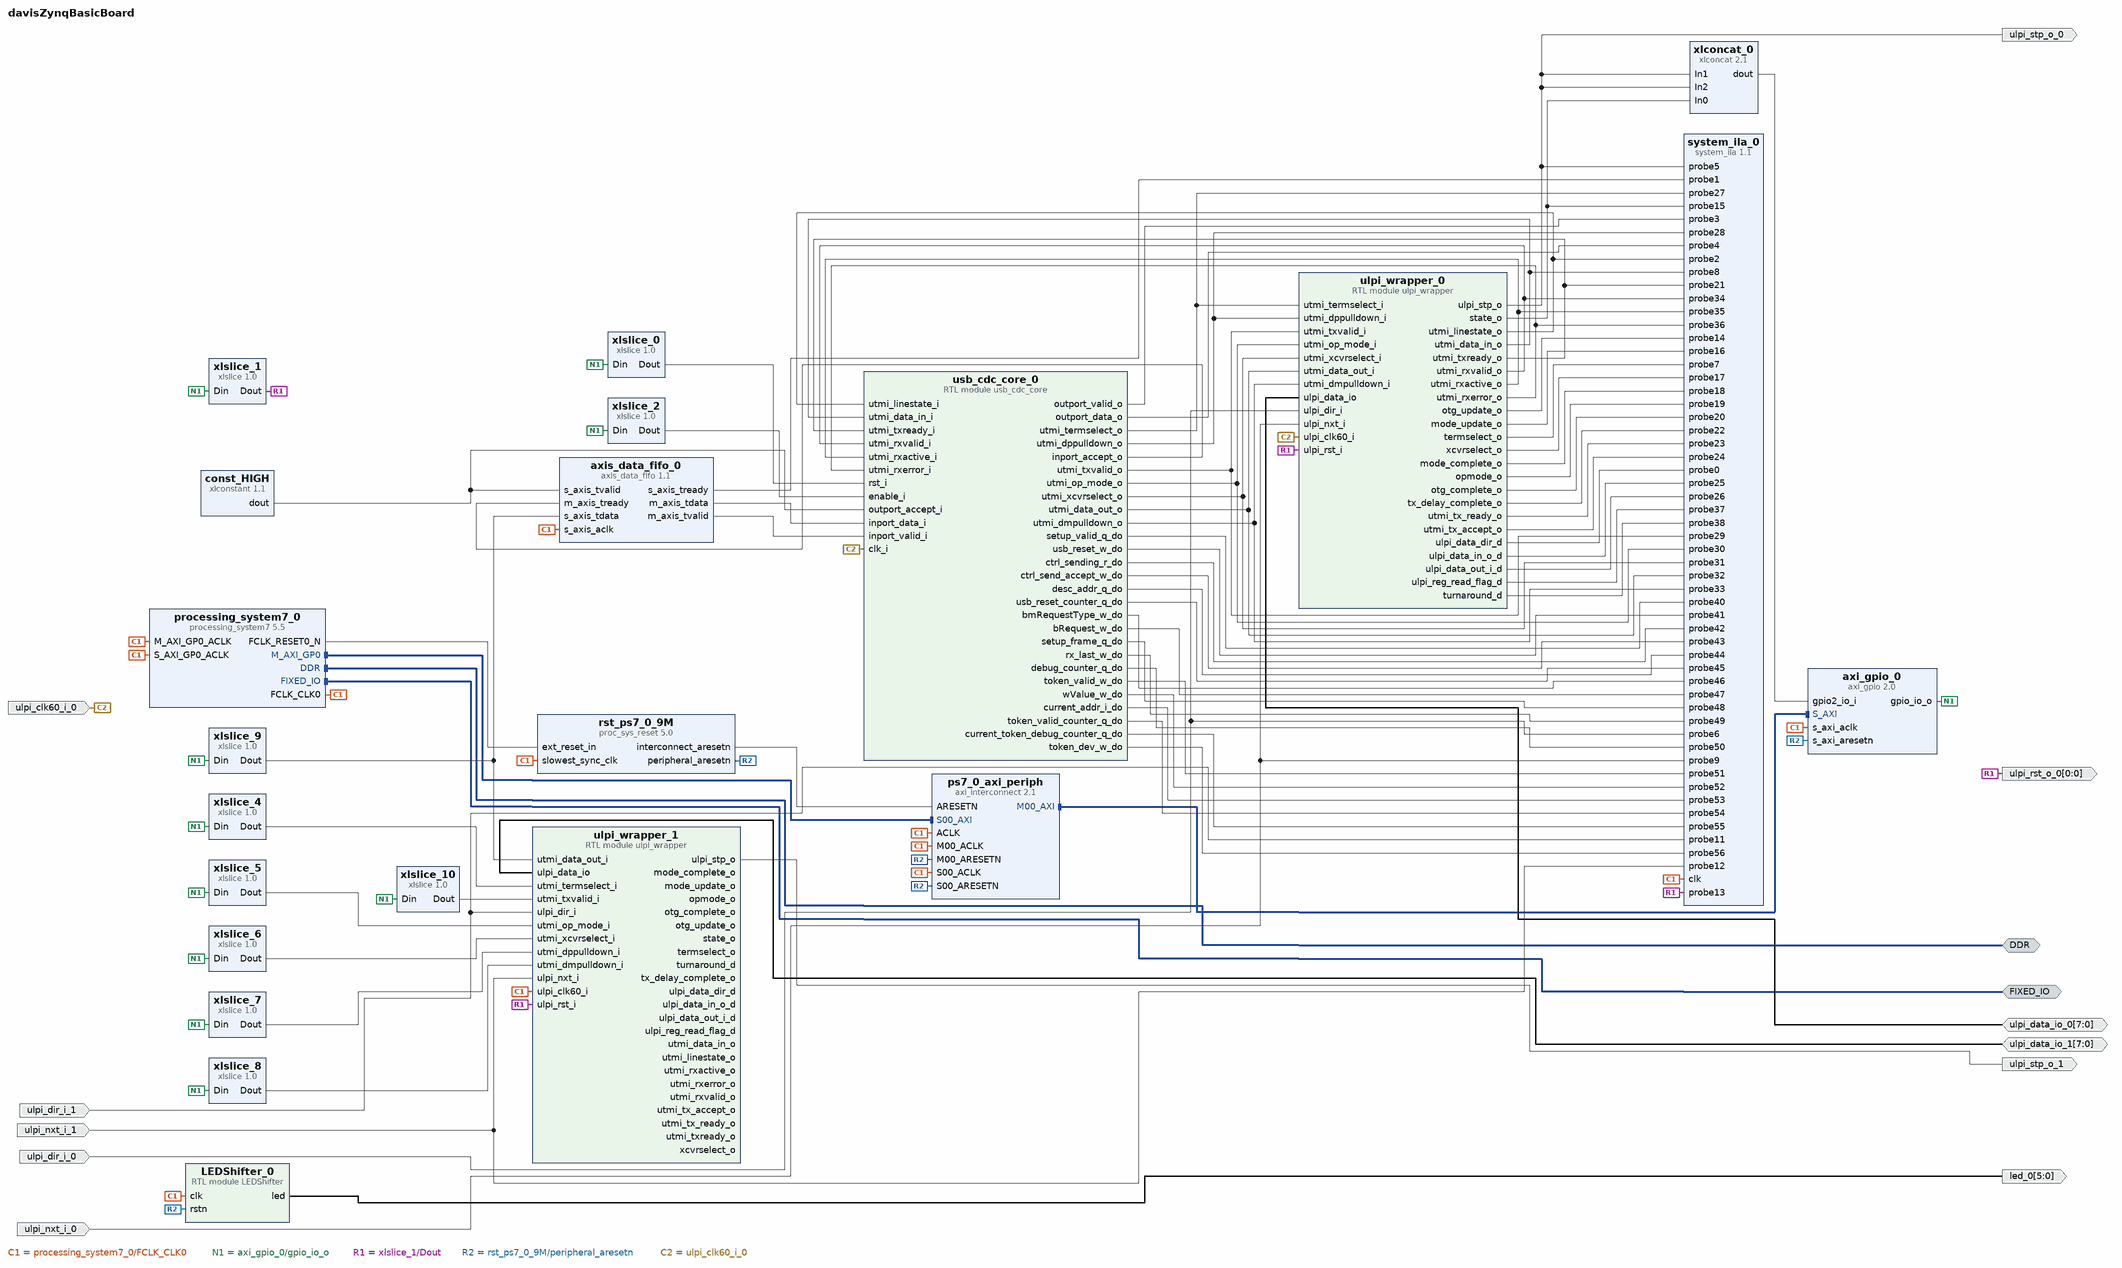
[diagram p0: block diagram of the top level]
# Vivado block design davisZynqBasicBoard, xc7z100ffg900-1, Vivado 2018.1
create_bd_design davisZynqBasicBoard

create_bd_intf_port -mode Master -vlnv xilinx.com:interface:ddrx_rtl:1.0 DDR
create_bd_intf_port -mode Master -vlnv xilinx.com:display_processing_system7:fixedio_rtl:1.0 FIXED_IO
create_bd_port -dir O -from 0 -to 0 ulpi_rst_o_0
create_bd_port -dir O ulpi_stp_o_0
create_bd_port -dir I ulpi_dir_i_0
create_bd_port -dir I ulpi_nxt_i_0
create_bd_port -dir IO -from 7 -to 0 ulpi_data_io_0
create_bd_port -dir I ulpi_dir_i_1
create_bd_port -dir I ulpi_nxt_i_1
create_bd_port -dir O ulpi_stp_o_1
create_bd_port -dir IO -from 7 -to 0 ulpi_data_io_1
create_bd_port -dir O -from 5 -to 0 led_0
create_bd_port -dir I ulpi_clk60_i_0

create_bd_cell -type ip -vlnv xilinx.com:ip:processing_system7:5.5 processing_system7_0
set_property -dict [list \
  CONFIG.PCW_FCLK_CLK2_BUF TRUE \
  CONFIG.PCW_UIPARAM_DDR_FREQ_MHZ 533.33333 \
  CONFIG.PCW_CRYSTAL_PERIPHERAL_FREQMHZ 33.33 \
  CONFIG.PCW_APU_PERIPHERAL_FREQMHZ 666.66666666666666666 \
  CONFIG.PCW_SDIO_PERIPHERAL_FREQMHZ 100 \
  CONFIG.PCW_UART_PERIPHERAL_FREQMHZ 100 \
  CONFIG.PCW_I2C_PERIPHERAL_FREQMHZ 111.099998 \
  CONFIG.PCW_FPGA0_PERIPHERAL_FREQMHZ 60 \
  CONFIG.PCW_FPGA1_PERIPHERAL_FREQMHZ 250 \
  CONFIG.PCW_FPGA2_PERIPHERAL_FREQMHZ 48 \
  CONFIG.PCW_USE_S_AXI_GP0 1 \
  CONFIG.PCW_USE_FABRIC_INTERRUPT 1 \
  CONFIG.PCW_EN_CLK2_PORT 1 \
  CONFIG.PCW_IRQ_F2P_INTR 1 \
  CONFIG.PCW_PERIPHERAL_BOARD_PRESET None \
  CONFIG.PCW_PRESET_BANK1_VOLTAGE {LVCMOS 3.3V} \
  CONFIG.PCW_UIPARAM_DDR_BUS_WIDTH {16 Bit} \
  CONFIG.PCW_UIPARAM_DDR_PARTNO Custom \
  CONFIG.PCW_NAND_PERIPHERAL_ENABLE 1 \
  CONFIG.PCW_NAND_NAND_IO {MIO 0 2.. 14} \
  CONFIG.PCW_ENET0_PERIPHERAL_ENABLE 0 \
  CONFIG.PCW_SD0_PERIPHERAL_ENABLE 1 \
  CONFIG.PCW_SD0_SD0_IO {MIO 16 .. 21} \
  CONFIG.PCW_SD0_GRP_CD_ENABLE 0 \
  CONFIG.PCW_SD0_GRP_WP_ENABLE 0 \
  CONFIG.PCW_UART0_PERIPHERAL_ENABLE 1 \
  CONFIG.PCW_UART0_UART0_IO {MIO 22 .. 23} \
  CONFIG.PCW_UART1_PERIPHERAL_ENABLE 0 \
  CONFIG.PCW_USB0_PERIPHERAL_ENABLE 1 \
  CONFIG.PCW_USB0_USB0_IO {MIO 28 .. 39} \
  CONFIG.PCW_USB1_PERIPHERAL_ENABLE 1 \
  CONFIG.PCW_USB1_USB1_IO {MIO 40 .. 51} \
  CONFIG.PCW_I2C0_PERIPHERAL_ENABLE 1 \
  CONFIG.PCW_I2C0_I2C0_IO {MIO 26 .. 27} \
  CONFIG.PCW_I2C0_GRP_INT_ENABLE 0 \
  CONFIG.PCW_I2C1_PERIPHERAL_ENABLE 1 \
  CONFIG.PCW_I2C1_I2C1_IO EMIO \
  CONFIG.PCW_GPIO_MIO_GPIO_ENABLE 0 \
  CONFIG.PCW_FPGA_FCLK2_ENABLE 1 \
] [get_bd_cells processing_system7_0]
# 502 more settings of processing_system7_0 are not shown: defaults, MIO pin electricals, DDR timing, and values the tool derives
create_bd_cell -type ip -vlnv xilinx.com:ip:proc_sys_reset:5.0 rst_ps7_0_9M
create_bd_cell -type ip -vlnv xilinx.com:ip:xlconstant:1.1 const_HIGH
create_bd_cell -type ip -vlnv xilinx.com:ip:axis_data_fifo:1.1 axis_data_fifo_0
create_bd_cell -type ip -vlnv xilinx.com:ip:system_ila:1.1 system_ila_0
set_property -dict [list \
  CONFIG.C_PROBE62_TYPE 0 \
  CONFIG.C_PROBE61_TYPE 0 \
  CONFIG.C_PROBE60_TYPE 0 \
  CONFIG.C_PROBE59_TYPE 0 \
  CONFIG.C_PROBE58_TYPE 0 \
  CONFIG.C_PROBE57_TYPE 0 \
  CONFIG.C_PROBE56_TYPE 0 \
  CONFIG.C_PROBE55_TYPE 0 \
  CONFIG.C_PROBE54_TYPE 0 \
  CONFIG.C_PROBE53_TYPE 0 \
  CONFIG.C_PROBE52_TYPE 0 \
  CONFIG.C_PROBE51_TYPE 0 \
  CONFIG.C_PROBE50_TYPE 0 \
  CONFIG.C_PROBE49_TYPE 0 \
  CONFIG.C_PROBE48_TYPE 0 \
  CONFIG.C_PROBE47_TYPE 0 \
  CONFIG.C_PROBE46_TYPE 0 \
  CONFIG.C_PROBE45_TYPE 0 \
  CONFIG.C_PROBE44_TYPE 0 \
  CONFIG.C_PROBE43_TYPE 0 \
  CONFIG.C_PROBE42_TYPE 0 \
  CONFIG.C_PROBE41_TYPE 0 \
  CONFIG.C_PROBE40_TYPE 0 \
  CONFIG.C_PROBE39_TYPE 0 \
  CONFIG.C_PROBE38_TYPE 0 \
  CONFIG.C_PROBE37_TYPE 0 \
  CONFIG.C_PROBE36_TYPE 0 \
  CONFIG.C_PROBE35_TYPE 0 \
  CONFIG.C_PROBE34_TYPE 0 \
  CONFIG.C_PROBE33_TYPE 0 \
  CONFIG.C_PROBE32_TYPE 0 \
  CONFIG.C_PROBE31_TYPE 0 \
  CONFIG.C_PROBE30_TYPE 0 \
  CONFIG.C_PROBE29_TYPE 0 \
  CONFIG.C_PROBE28_TYPE 0 \
  CONFIG.C_PROBE27_TYPE 0 \
  CONFIG.C_PROBE26_TYPE 0 \
  CONFIG.C_PROBE25_TYPE 0 \
  CONFIG.C_PROBE24_TYPE 0 \
  CONFIG.C_PROBE23_TYPE 0 \
  CONFIG.C_PROBE22_TYPE 0 \
  CONFIG.C_PROBE21_TYPE 0 \
  CONFIG.C_PROBE20_TYPE 0 \
  CONFIG.C_PROBE19_TYPE 0 \
  CONFIG.C_PROBE18_TYPE 0 \
  CONFIG.C_PROBE17_TYPE 0 \
  CONFIG.C_PROBE16_TYPE 0 \
  CONFIG.C_PROBE15_TYPE 0 \
  CONFIG.C_PROBE14_TYPE 0 \
  CONFIG.C_PROBE13_TYPE 0 \
  CONFIG.C_PROBE12_TYPE 0 \
  CONFIG.C_PROBE11_TYPE 0 \
  CONFIG.C_PROBE10_TYPE 0 \
  CONFIG.C_PROBE9_TYPE 0 \
  CONFIG.C_PROBE8_TYPE 0 \
  CONFIG.C_PROBE7_TYPE 0 \
  CONFIG.C_PROBE6_TYPE 0 \
  CONFIG.C_PROBE5_TYPE 0 \
  CONFIG.C_PROBE0_TYPE 0 \
  CONFIG.C_DATA_DEPTH 32768 \
  CONFIG.C_NUM_OF_PROBES 57 \
  CONFIG.C_MON_TYPE NATIVE \
] [get_bd_cells system_ila_0]
create_bd_cell -type ip -vlnv xilinx.com:ip:axi_gpio:2.0 axi_gpio_0
set_property -dict [list \
  CONFIG.C_IS_DUAL 1 \
  CONFIG.C_DOUT_DEFAULT 0x00000000 \
  CONFIG.C_ALL_INPUTS_2 1 \
  CONFIG.C_ALL_OUTPUTS 1 \
] [get_bd_cells axi_gpio_0]
create_bd_cell -type ip -vlnv xilinx.com:ip:xlslice:1.0 xlslice_0
set_property -dict {CONFIG.DIN_TO 0 CONFIG.DIN_FROM 0 CONFIG.DIN_WIDTH 32} [get_bd_cells xlslice_0]
create_bd_cell -type ip -vlnv xilinx.com:ip:xlslice:1.0 xlslice_1
set_property -dict {CONFIG.DIN_TO 1 CONFIG.DIN_FROM 1 CONFIG.DOUT_WIDTH 1} [get_bd_cells xlslice_1]
create_bd_cell -type ip -vlnv xilinx.com:ip:xlslice:1.0 xlslice_4
set_property -dict {CONFIG.DIN_TO 4 CONFIG.DIN_FROM 4 CONFIG.DOUT_WIDTH 1} [get_bd_cells xlslice_4]
create_bd_cell -type ip -vlnv xilinx.com:ip:xlslice:1.0 xlslice_5
set_property -dict {CONFIG.DIN_TO 5 CONFIG.DIN_FROM 6 CONFIG.DOUT_WIDTH 2} [get_bd_cells xlslice_5]
create_bd_cell -type ip -vlnv xilinx.com:ip:xlslice:1.0 xlslice_6
set_property -dict {CONFIG.DIN_TO 7 CONFIG.DIN_FROM 8 CONFIG.DOUT_WIDTH 2} [get_bd_cells xlslice_6]
create_bd_cell -type ip -vlnv xilinx.com:ip:xlslice:1.0 xlslice_7
set_property -dict {CONFIG.DIN_TO 9 CONFIG.DIN_FROM 9 CONFIG.DOUT_WIDTH 1} [get_bd_cells xlslice_7]
create_bd_cell -type ip -vlnv xilinx.com:ip:xlslice:1.0 xlslice_8
set_property -dict {CONFIG.DIN_TO 10 CONFIG.DIN_FROM 10 CONFIG.DOUT_WIDTH 1} [get_bd_cells xlslice_8]
create_bd_cell -type ip -vlnv xilinx.com:ip:xlslice:1.0 xlslice_9
set_property -dict {CONFIG.DIN_TO 24 CONFIG.DIN_FROM 31 CONFIG.DOUT_WIDTH 8} [get_bd_cells xlslice_9]
create_bd_cell -type ip -vlnv xilinx.com:ip:xlslice:1.0 xlslice_10
set_property -dict {CONFIG.DIN_TO 23 CONFIG.DIN_FROM 23 CONFIG.DOUT_WIDTH 1} [get_bd_cells xlslice_10]
create_bd_cell -type ip -vlnv xilinx.com:ip:xlconcat:2.1 xlconcat_0
set_property -dict {CONFIG.NUM_PORTS 3 CONFIG.IN0_WIDTH 4 CONFIG.IN1_WIDTH 4 CONFIG.IN2_WIDTH 4} [get_bd_cells xlconcat_0]
create_bd_cell -type ip -vlnv xilinx.com:ip:axi_interconnect:2.1 ps7_0_axi_periph
set_property -dict {CONFIG.NUM_SI 1 CONFIG.NUM_MI 1} [get_bd_cells ps7_0_axi_periph]
create_bd_cell -type module -reference ulpi_wrapper ulpi_wrapper_0
create_bd_cell -type module -reference ulpi_wrapper ulpi_wrapper_1
create_bd_cell -type module -reference LEDShifter LEDShifter_0
create_bd_cell -type ip -vlnv xilinx.com:ip:xlslice:1.0 xlslice_2
set_property -dict {CONFIG.DIN_TO 2 CONFIG.DIN_FROM 2 CONFIG.DOUT_WIDTH 1} [get_bd_cells xlslice_2]
create_bd_cell -type module -reference usb_cdc_core usb_cdc_core_0

# ---- connections ----

connect_bd_intf_net [get_bd_intf_pins processing_system7_0/M_AXI_GP0] [get_bd_intf_pins ps7_0_axi_periph/S00_AXI]
connect_bd_intf_net [get_bd_intf_pins ps7_0_axi_periph/M00_AXI] [get_bd_intf_pins axi_gpio_0/S_AXI]
connect_bd_intf_net [get_bd_intf_ports DDR] [get_bd_intf_pins processing_system7_0/DDR]
connect_bd_intf_net [get_bd_intf_ports FIXED_IO] [get_bd_intf_pins processing_system7_0/FIXED_IO]
connect_bd_net [get_bd_pins processing_system7_0/FCLK_CLK0] \
  [get_bd_pins rst_ps7_0_9M/slowest_sync_clk] [get_bd_pins processing_system7_0/M_AXI_GP0_ACLK] \
  [get_bd_pins axis_data_fifo_0/s_axis_aclk] [get_bd_pins processing_system7_0/S_AXI_GP0_ACLK] \
  [get_bd_pins axi_gpio_0/s_axi_aclk] [get_bd_pins LEDShifter_0/clk] [get_bd_pins ulpi_wrapper_1/ulpi_clk60_i] \
  [get_bd_pins system_ila_0/clk] [get_bd_pins ps7_0_axi_periph/ACLK] [get_bd_pins ps7_0_axi_periph/S00_ACLK] \
  [get_bd_pins ps7_0_axi_periph/M00_ACLK]
connect_bd_net [get_bd_pins processing_system7_0/FCLK_RESET0_N] [get_bd_pins rst_ps7_0_9M/ext_reset_in]
connect_bd_net [get_bd_pins const_HIGH/dout] [get_bd_pins axis_data_fifo_0/s_axis_tvalid] [get_bd_pins usb_cdc_core_0/outport_accept_i]
connect_bd_net -net usb_fs_phy_0_utmi_linestate_o [get_bd_pins ulpi_wrapper_0/utmi_linestate_o] \
  [get_bd_pins system_ila_0/probe2] [get_bd_pins usb_cdc_core_0/utmi_linestate_i]
connect_bd_net [get_bd_pins axis_data_fifo_0/m_axis_tdata] [get_bd_pins usb_cdc_core_0/inport_data_i]
connect_bd_net [get_bd_pins axis_data_fifo_0/m_axis_tvalid] [get_bd_pins usb_cdc_core_0/inport_valid_i]
connect_bd_net [get_bd_pins usb_cdc_core_0/inport_accept_o] [get_bd_pins axis_data_fifo_0/m_axis_tready]
connect_bd_net [get_bd_pins axis_data_fifo_0/s_axis_tready] [get_bd_pins system_ila_0/probe1]
connect_bd_net -net outport_valid_o [get_bd_pins usb_cdc_core_0/outport_valid_o] [get_bd_pins system_ila_0/probe3]
connect_bd_net -net outport_data_o [get_bd_pins usb_cdc_core_0/outport_data_o] [get_bd_pins system_ila_0/probe4]
connect_bd_net [get_bd_pins axi_gpio_0/gpio_io_o] \
  [get_bd_pins xlslice_0/Din] [get_bd_pins xlslice_1/Din] [get_bd_pins xlslice_5/Din] [get_bd_pins xlslice_4/Din] \
  [get_bd_pins xlslice_6/Din] [get_bd_pins xlslice_8/Din] [get_bd_pins xlslice_7/Din] [get_bd_pins xlslice_9/Din] \
  [get_bd_pins xlslice_10/Din] [get_bd_pins xlslice_2/Din]
connect_bd_net [get_bd_pins ulpi_wrapper_0/utmi_data_in_o] [get_bd_pins system_ila_0/probe8] [get_bd_pins usb_cdc_core_0/utmi_data_in_i]
connect_bd_net [get_bd_pins ulpi_wrapper_0/utmi_txready_o] [get_bd_pins system_ila_0/probe21] [get_bd_pins usb_cdc_core_0/utmi_txready_i]
connect_bd_net [get_bd_pins ulpi_wrapper_0/utmi_rxvalid_o] [get_bd_pins system_ila_0/probe34] [get_bd_pins usb_cdc_core_0/utmi_rxvalid_i]
connect_bd_net [get_bd_pins ulpi_wrapper_0/utmi_rxactive_o] [get_bd_pins system_ila_0/probe35] [get_bd_pins usb_cdc_core_0/utmi_rxactive_i]
connect_bd_net [get_bd_pins ulpi_wrapper_0/utmi_rxerror_o] [get_bd_pins system_ila_0/probe36] [get_bd_pins usb_cdc_core_0/utmi_rxerror_i]
connect_bd_net -net xlslice_2_Dout [get_bd_pins xlslice_1/Dout] \
  [get_bd_ports ulpi_rst_o_0] [get_bd_pins ulpi_wrapper_1/ulpi_rst_i] [get_bd_pins system_ila_0/probe13] \
  [get_bd_pins ulpi_wrapper_0/ulpi_rst_i]
connect_bd_net -net otg_update_o [get_bd_pins ulpi_wrapper_0/otg_update_o] [get_bd_pins system_ila_0/probe14]
connect_bd_net -net state_o [get_bd_pins ulpi_wrapper_0/state_o] [get_bd_pins xlconcat_0/In0] [get_bd_pins system_ila_0/probe15]
connect_bd_net -net mode_update_o [get_bd_pins ulpi_wrapper_0/mode_update_o] [get_bd_pins system_ila_0/probe16]
connect_bd_net -net termselect_o [get_bd_pins ulpi_wrapper_0/termselect_o] [get_bd_pins system_ila_0/probe7]
connect_bd_net -net xcvrselect_o [get_bd_pins ulpi_wrapper_0/xcvrselect_o] [get_bd_pins system_ila_0/probe17]
connect_bd_net -net mode_complete_o [get_bd_pins ulpi_wrapper_0/mode_complete_o] [get_bd_pins system_ila_0/probe18]
connect_bd_net -net opmode_o [get_bd_pins ulpi_wrapper_0/opmode_o] [get_bd_pins system_ila_0/probe19]
connect_bd_net -net otg_complete_o [get_bd_pins ulpi_wrapper_0/otg_complete_o] [get_bd_pins system_ila_0/probe20]
connect_bd_net -net tx_delay_complete_o [get_bd_pins ulpi_wrapper_0/tx_delay_complete_o] [get_bd_pins system_ila_0/probe22]
connect_bd_net -net utmi_tx_ready_o [get_bd_pins ulpi_wrapper_0/utmi_tx_ready_o] [get_bd_pins system_ila_0/probe23]
connect_bd_net -net utmi_tx_accept_o [get_bd_pins ulpi_wrapper_0/utmi_tx_accept_o] [get_bd_pins system_ila_0/probe24]
connect_bd_net [get_bd_pins ulpi_wrapper_0/ulpi_stp_o] \
  [get_bd_ports ulpi_stp_o_0] [get_bd_pins system_ila_0/probe5] [get_bd_pins xlconcat_0/In2] [get_bd_pins xlconcat_0/In1]
connect_bd_net -net ulpi_dir_i_0_1 [get_bd_ports ulpi_dir_i_0] [get_bd_pins system_ila_0/probe6] [get_bd_pins ulpi_wrapper_0/ulpi_dir_i]
connect_bd_net -net ulpi_nxt_i_0_1 [get_bd_ports ulpi_nxt_i_0] [get_bd_pins system_ila_0/probe9] [get_bd_pins ulpi_wrapper_0/ulpi_nxt_i]
connect_bd_net -net ulpi_data_dir_d [get_bd_pins ulpi_wrapper_0/ulpi_data_dir_d] [get_bd_pins system_ila_0/probe0]
connect_bd_net -net ulpi_data_in_o_d [get_bd_pins ulpi_wrapper_0/ulpi_data_in_o_d] [get_bd_pins system_ila_0/probe25]
connect_bd_net [get_bd_ports ulpi_data_io_0] [get_bd_pins ulpi_wrapper_0/ulpi_data_io]
connect_bd_net -net ulpi_data_out_i_d [get_bd_pins ulpi_wrapper_0/ulpi_data_out_i_d] [get_bd_pins system_ila_0/probe26]
connect_bd_net -net utmi_termselect_o [get_bd_pins usb_cdc_core_0/utmi_termselect_o] \
  [get_bd_pins ulpi_wrapper_0/utmi_termselect_i] [get_bd_pins system_ila_0/probe27]
connect_bd_net -net utmi_dppulldown_o [get_bd_pins usb_cdc_core_0/utmi_dppulldown_o] \
  [get_bd_pins ulpi_wrapper_0/utmi_dppulldown_i] [get_bd_pins system_ila_0/probe28]
connect_bd_net -net utmi_txvalid_o [get_bd_pins usb_cdc_core_0/utmi_txvalid_o] \
  [get_bd_pins ulpi_wrapper_0/utmi_txvalid_i] [get_bd_pins system_ila_0/probe29]
connect_bd_net -net utmi_op_mode_o [get_bd_pins usb_cdc_core_0/utmi_op_mode_o] \
  [get_bd_pins ulpi_wrapper_0/utmi_op_mode_i] [get_bd_pins system_ila_0/probe30]
connect_bd_net -net utmi_xcvrselect_o [get_bd_pins usb_cdc_core_0/utmi_xcvrselect_o] \
  [get_bd_pins ulpi_wrapper_0/utmi_xcvrselect_i] [get_bd_pins system_ila_0/probe31]
connect_bd_net -net utmi_data_out_o [get_bd_pins usb_cdc_core_0/utmi_data_out_o] \
  [get_bd_pins ulpi_wrapper_0/utmi_data_out_i] [get_bd_pins system_ila_0/probe32]
connect_bd_net -net utmi_dmpulldown_o [get_bd_pins usb_cdc_core_0/utmi_dmpulldown_o] \
  [get_bd_pins ulpi_wrapper_0/utmi_dmpulldown_i] [get_bd_pins system_ila_0/probe33]
connect_bd_net [get_bd_pins rst_ps7_0_9M/peripheral_aresetn] \
  [get_bd_pins axi_gpio_0/s_axi_aresetn] [get_bd_pins LEDShifter_0/rstn] [get_bd_pins ps7_0_axi_periph/S00_ARESETN] \
  [get_bd_pins ps7_0_axi_periph/M00_ARESETN]
connect_bd_net [get_bd_pins xlconcat_0/dout] [get_bd_pins axi_gpio_0/gpio2_io_i]
connect_bd_net -net ulpi_reg_read_flag_d [get_bd_pins ulpi_wrapper_0/ulpi_reg_read_flag_d] [get_bd_pins system_ila_0/probe37]
connect_bd_net [get_bd_pins rst_ps7_0_9M/interconnect_aresetn] [get_bd_pins ps7_0_axi_periph/ARESETN]
connect_bd_net -net turnaround_d [get_bd_pins ulpi_wrapper_0/turnaround_d] [get_bd_pins system_ila_0/probe38]
connect_bd_net [get_bd_pins xlslice_9/Dout] [get_bd_pins axis_data_fifo_0/s_axis_tdata] [get_bd_pins ulpi_wrapper_1/utmi_data_out_i]
connect_bd_net -net ulpi_dir_i_1_1 [get_bd_ports ulpi_dir_i_1] [get_bd_pins ulpi_wrapper_1/ulpi_dir_i] [get_bd_pins system_ila_0/probe11]
connect_bd_net -net ulpi_nxt_i_1_1 [get_bd_ports ulpi_nxt_i_1] [get_bd_pins ulpi_wrapper_1/ulpi_nxt_i] [get_bd_pins system_ila_0/probe12]
connect_bd_net [get_bd_pins ulpi_wrapper_1/ulpi_stp_o] [get_bd_ports ulpi_stp_o_1]
connect_bd_net [get_bd_ports ulpi_data_io_1] [get_bd_pins ulpi_wrapper_1/ulpi_data_io]
connect_bd_net [get_bd_pins xlslice_10/Dout] [get_bd_pins ulpi_wrapper_1/utmi_txvalid_i]
# net state_o_1 has one end: ulpi_wrapper_1/state_o
# net mode_complete_o_1 has one end: ulpi_wrapper_1/mode_complete_o
# net otg_complete_o_1 has one end: ulpi_wrapper_1/otg_complete_o
# net mode_update_o_1 has one end: ulpi_wrapper_1/mode_update_o
# net otg_update_o_1 has one end: ulpi_wrapper_1/otg_update_o
connect_bd_net [get_bd_pins xlslice_4/Dout] [get_bd_pins ulpi_wrapper_1/utmi_termselect_i]
connect_bd_net [get_bd_pins xlslice_5/Dout] [get_bd_pins ulpi_wrapper_1/utmi_op_mode_i]
connect_bd_net [get_bd_pins xlslice_6/Dout] [get_bd_pins ulpi_wrapper_1/utmi_xcvrselect_i]
connect_bd_net [get_bd_pins xlslice_7/Dout] [get_bd_pins ulpi_wrapper_1/utmi_dppulldown_i]
connect_bd_net [get_bd_pins xlslice_8/Dout] [get_bd_pins ulpi_wrapper_1/utmi_dmpulldown_i]
# net ulpi_data_dir_d_1 has one end: ulpi_wrapper_1/ulpi_data_dir_d
# net utmi_tx_ready_o_1 has one end: ulpi_wrapper_1/utmi_tx_ready_o
# net utmi_tx_accept_o_1 has one end: ulpi_wrapper_1/utmi_tx_accept_o
# net tx_delay_complete_o_1 has one end: ulpi_wrapper_1/tx_delay_complete_o
# net opmode_o_1 has one end: ulpi_wrapper_1/opmode_o
# net xcvrselect_o_1 has one end: ulpi_wrapper_1/xcvrselect_o
# net utmi_txready_o has one end: ulpi_wrapper_1/utmi_txready_o
# net ulpi_reg_read_flag_d_1 has one end: ulpi_wrapper_1/ulpi_reg_read_flag_d
# net turnaround_d_1 has one end: ulpi_wrapper_1/turnaround_d
# net utmi_rxerror_o has one end: ulpi_wrapper_1/utmi_rxerror_o
# net utmi_rxvalid_o has one end: ulpi_wrapper_1/utmi_rxvalid_o
# net termselect_o_1 has one end: ulpi_wrapper_1/termselect_o
# net utmi_rxactive_o has one end: ulpi_wrapper_1/utmi_rxactive_o
# net utmi_data_in_o has one end: ulpi_wrapper_1/utmi_data_in_o
# net ulpi_data_in_o_d_1 has one end: ulpi_wrapper_1/ulpi_data_in_o_d
# net ulpi_data_out_i_d_1 has one end: ulpi_wrapper_1/ulpi_data_out_i_d
# net utmi_linestate_o has one end: ulpi_wrapper_1/utmi_linestate_o
connect_bd_net -net setup_valid_q_do [get_bd_pins usb_cdc_core_0/setup_valid_q_do] [get_bd_pins system_ila_0/probe40]
connect_bd_net -net usb_reset_w_do [get_bd_pins usb_cdc_core_0/usb_reset_w_do] [get_bd_pins system_ila_0/probe41]
connect_bd_net -net ctrl_sending_r_do [get_bd_pins usb_cdc_core_0/ctrl_sending_r_do] [get_bd_pins system_ila_0/probe42]
connect_bd_net -net ctrl_send_accept_w_do [get_bd_pins usb_cdc_core_0/ctrl_send_accept_w_do] [get_bd_pins system_ila_0/probe43]
connect_bd_net -net desc_addr_q_do [get_bd_pins usb_cdc_core_0/desc_addr_q_do] [get_bd_pins system_ila_0/probe44]
connect_bd_net -net usb_reset_counter_q_do [get_bd_pins usb_cdc_core_0/usb_reset_counter_q_do] [get_bd_pins system_ila_0/probe45]
connect_bd_net -net bmRequestType_w_do [get_bd_pins usb_cdc_core_0/bmRequestType_w_do] [get_bd_pins system_ila_0/probe46]
connect_bd_net -net bRequest_w_do [get_bd_pins usb_cdc_core_0/bRequest_w_do] [get_bd_pins system_ila_0/probe47]
connect_bd_net -net setup_frame_q_do [get_bd_pins usb_cdc_core_0/setup_frame_q_do] [get_bd_pins system_ila_0/probe48]
connect_bd_net -net rx_last_w_do [get_bd_pins usb_cdc_core_0/rx_last_w_do] [get_bd_pins system_ila_0/probe49]
connect_bd_net -net debug_counter_q_do [get_bd_pins usb_cdc_core_0/debug_counter_q_do] [get_bd_pins system_ila_0/probe50]
connect_bd_net [get_bd_pins xlslice_0/Dout] [get_bd_pins usb_cdc_core_0/rst_i]
connect_bd_net -net token_valid_w_do [get_bd_pins usb_cdc_core_0/token_valid_w_do] [get_bd_pins system_ila_0/probe51]
connect_bd_net -net wValue_w_do [get_bd_pins usb_cdc_core_0/wValue_w_do] [get_bd_pins system_ila_0/probe52]
connect_bd_net -net current_addr_i_do [get_bd_pins usb_cdc_core_0/current_addr_i_do] [get_bd_pins system_ila_0/probe53]
connect_bd_net -net token_valid_counter_q_do [get_bd_pins usb_cdc_core_0/token_valid_counter_q_do] [get_bd_pins system_ila_0/probe54]
connect_bd_net -net current_token_debug_counter_q_do [get_bd_pins usb_cdc_core_0/current_token_debug_counter_q_do] [get_bd_pins system_ila_0/probe55]
connect_bd_net -net token_dev_w_do [get_bd_pins usb_cdc_core_0/token_dev_w_do] [get_bd_pins system_ila_0/probe56]
connect_bd_net [get_bd_pins LEDShifter_0/led] [get_bd_ports led_0]
connect_bd_net [get_bd_pins xlslice_2/Dout] [get_bd_pins usb_cdc_core_0/enable_i]
connect_bd_net -net ulpi_clk60_i_0_1 [get_bd_ports ulpi_clk60_i_0] [get_bd_pins ulpi_wrapper_0/ulpi_clk60_i] [get_bd_pins usb_cdc_core_0/clk_i]

# ---- address map ----
assign_bd_address -offset 0x41200000 -range 64K -target_address_space [get_bd_addr_spaces processing_system7_0/Data] [get_bd_addr_segs axi_gpio_0/S_AXI/Reg]

validate_bd_design
save_bd_design
